# Altium schematic sheet 02cpu_power.SchDoc
size C
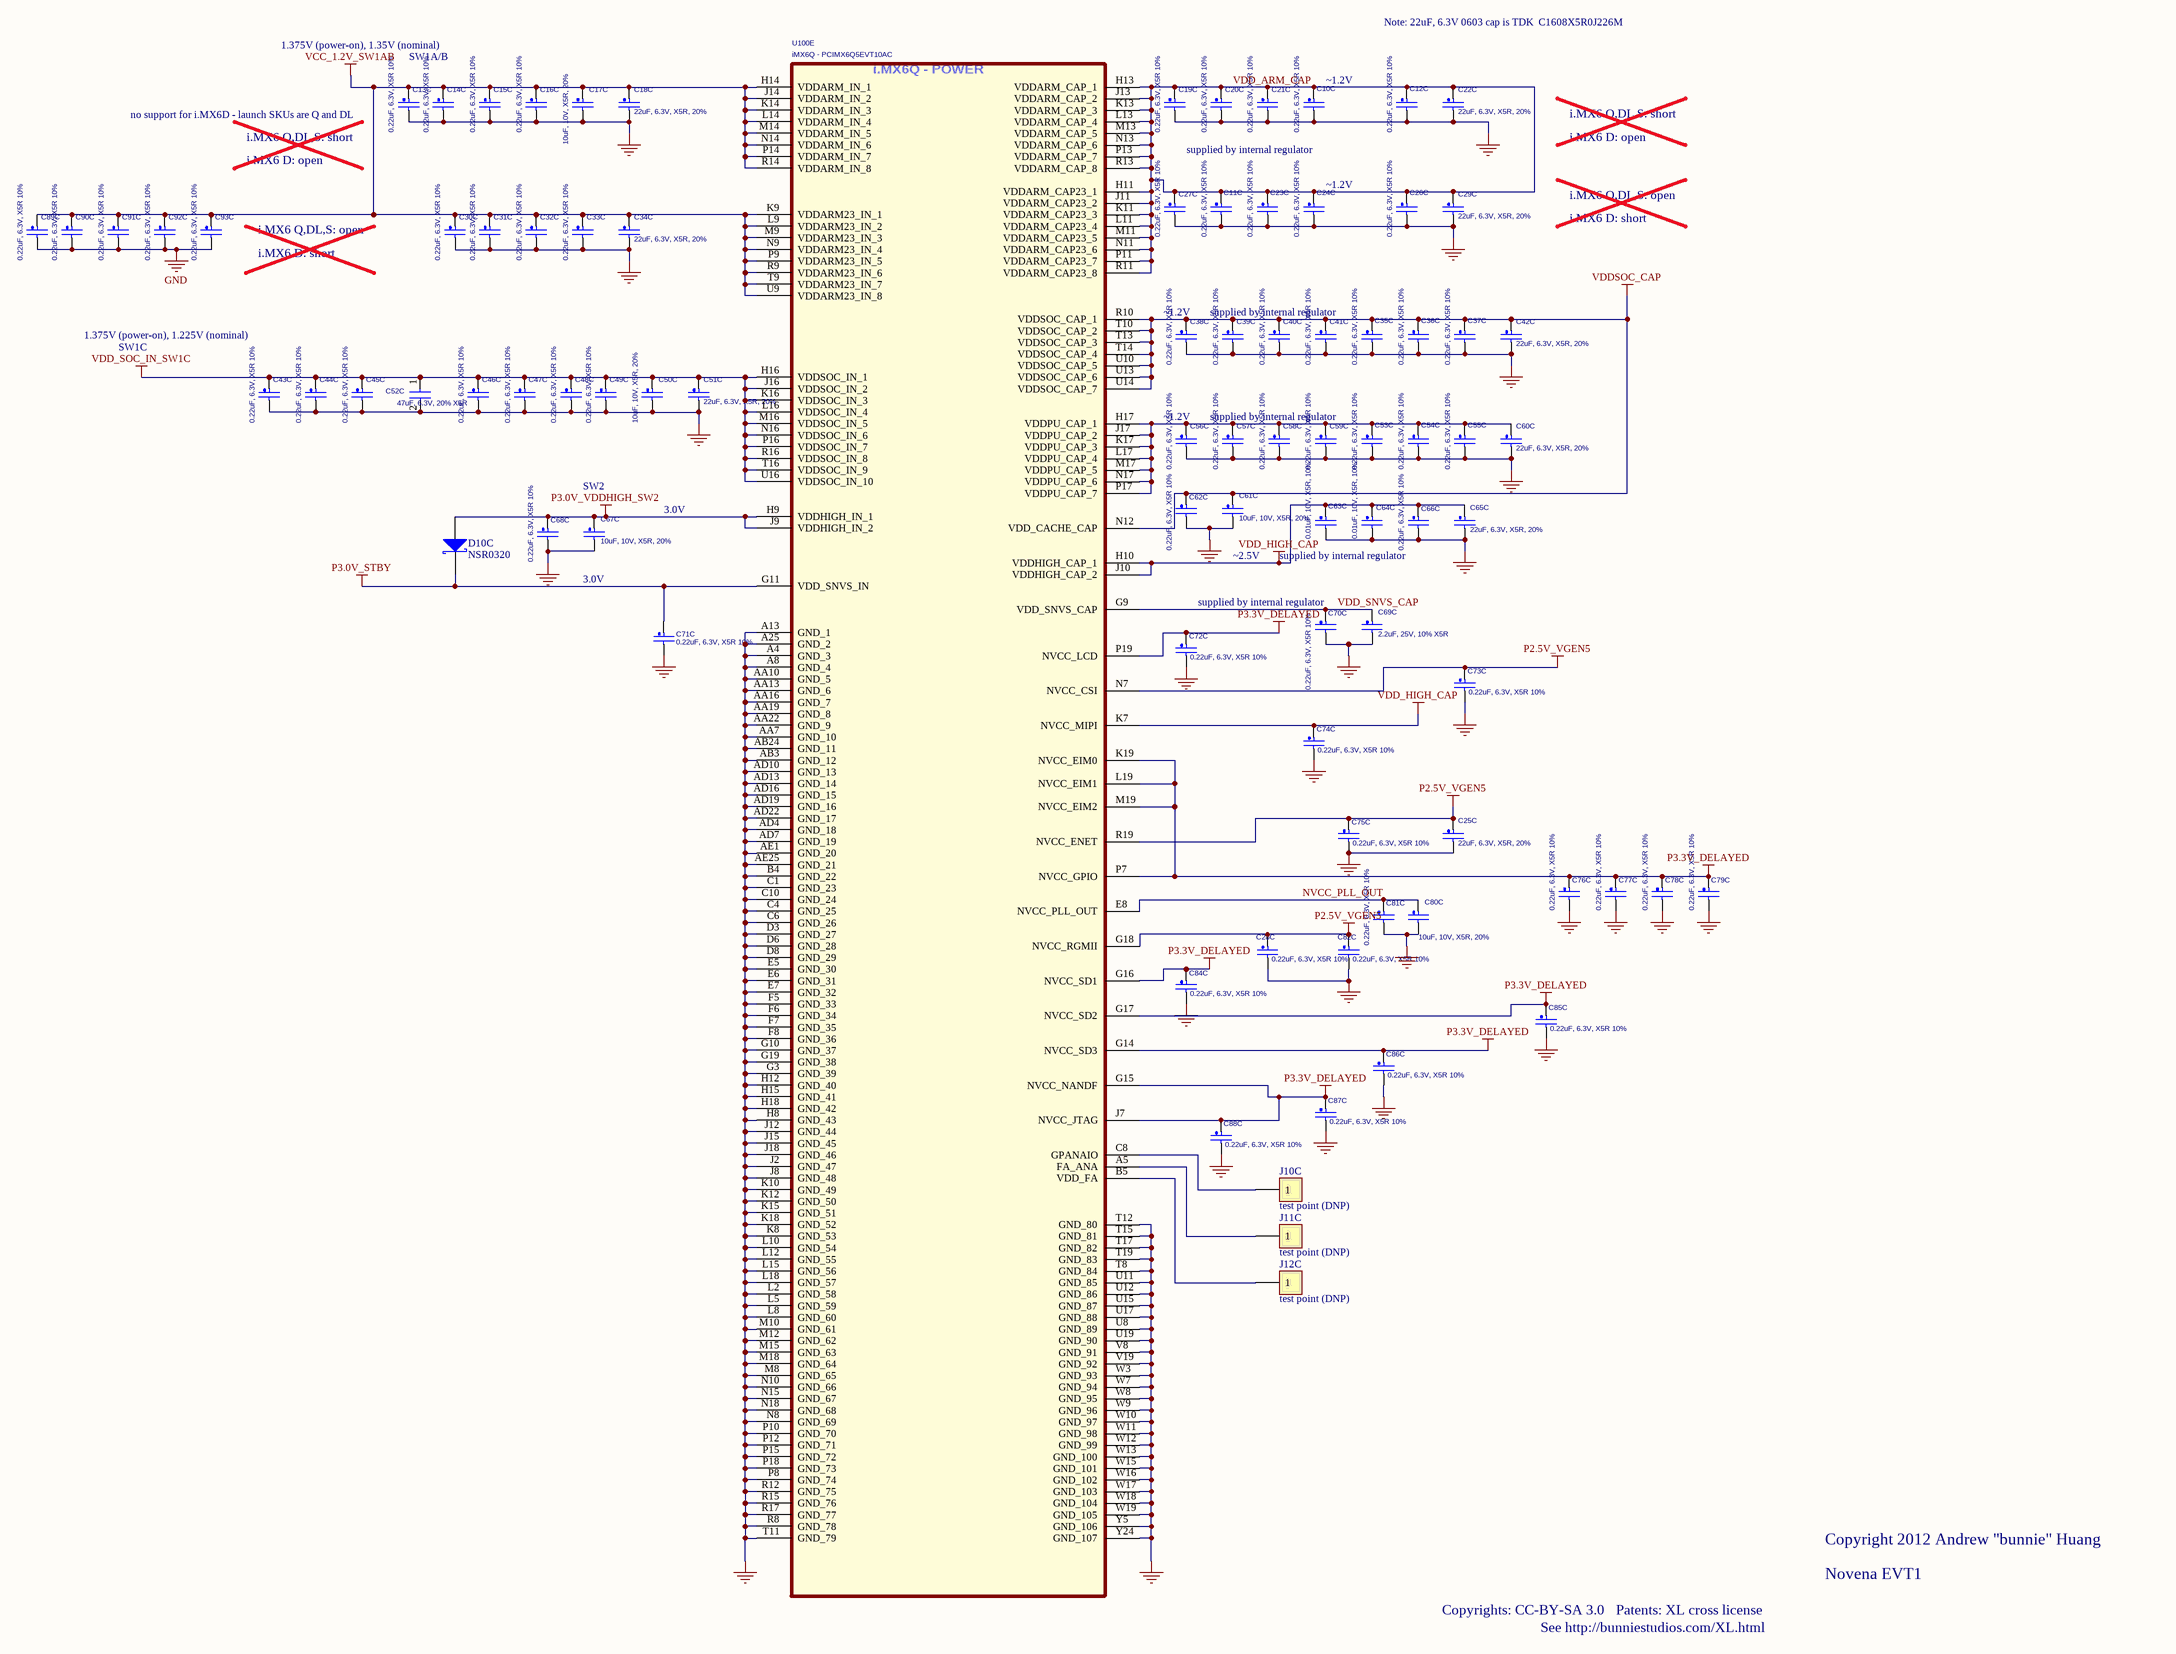
[diagram p0: 02cpu_power.SchDoc]

## Parts
C10C  0.22uF, 6.3V, X5R 10%  [CAPC0603N_B]
C11C  0.22uF, 6.3V, X5R 10%  [CAPC0603N_B]
C12C  0.22uF, 6.3V, X5R 10%  [CAPC0603N_B]
C13C  0.22uF, 6.3V, X5R 10%  [CAPC0603N_B]
C14C  0.22uF, 6.3V, X5R 10%  [CAPC0603N_B]
C15C  0.22uF, 6.3V, X5R 10%  [CAPC0603N_B]
C16C  0.22uF, 6.3V, X5R 10%  [CAPC0603N_B]
C17C  10uF, 10V, X5R, 20%  [CAPC1608N_HD]
C18C  22uF, 6.3V, X5R, 20%  [CAPC1608N_HD]
C19C  0.22uF, 6.3V, X5R 10%  [CAPC0603N_B]
C20C  0.22uF, 6.3V, X5R 10%  [CAPC0603N_B]
C21C  0.22uF, 6.3V, X5R 10%  [CAPC0603N_B]
C22C  22uF, 6.3V, X5R, 20%  [CAPC1608N_HD]
C23C  0.22uF, 6.3V, X5R 10%  [CAPC0603N_B]
C24C  0.22uF, 6.3V, X5R 10%  [CAPC0603N_B]
C25C  22uF, 6.3V, X5R, 20%  [CAPC1608N_HD]
C26C  0.22uF, 6.3V, X5R 10%  [CAPC0603N_B]
C27C  0.22uF, 6.3V, X5R 10%  [CAPC0603N_B]
C28C  0.22uF, 6.3V, X5R 10%  [CAPC0603N_B]
C29C  22uF, 6.3V, X5R, 20%  [CAPC1608N_HD]
C30C  0.22uF, 6.3V, X5R 10%  [CAPC0603N_B]
C31C  0.22uF, 6.3V, X5R 10%  [CAPC0603N_B]
C32C  0.22uF, 6.3V, X5R 10%  [CAPC0603N_B]
C33C  0.22uF, 6.3V, X5R 10%  [CAPC0603N_B]
C34C  22uF, 6.3V, X5R, 20%  [CAPC1608N_HD]
C35C  0.22uF, 6.3V, X5R 10%  [CAPC0603N_B]
C36C  0.22uF, 6.3V, X5R 10%  [CAPC0603N_B]
C37C  0.22uF, 6.3V, X5R 10%  [CAPC0603N_B]
C38C  0.22uF, 6.3V, X5R 10%  [CAPC0603N_B]
C39C  0.22uF, 6.3V, X5R 10%  [CAPC0603N_B]
C40C  0.22uF, 6.3V, X5R 10%  [CAPC0603N_B]
C41C  0.22uF, 6.3V, X5R 10%  [CAPC0603N_B]
C42C  22uF, 6.3V, X5R, 20%  [CAPC1608N_HD]
C43C  0.22uF, 6.3V, X5R 10%  [CAPC0603N_B]
C44C  0.22uF, 6.3V, X5R 10%  [CAPC0603N_B]
C45C  0.22uF, 6.3V, X5R 10%  [CAPC0603N_B]
C46C  0.22uF, 6.3V, X5R 10%  [CAPC0603N_B]
C47C  0.22uF, 6.3V, X5R 10%  [CAPC0603N_B]
C48C  0.22uF, 6.3V, X5R 10%  [CAPC0603N_B]
C49C  0.22uF, 6.3V, X5R 10%  [CAPC0603N_B]
C50C  10uF, 10V, X5R, 20%  [CAPC1608N_HD]
C51C  22uF, 6.3V, X5R, 20%  [CAPC1608N_HD]
C52C  47uF, 6.3V, 20% X5R  [CAPC3216N]
C53C  0.22uF, 6.3V, X5R 10%  [CAPC0603N_B]
C54C  0.22uF, 6.3V, X5R 10%  [CAPC0603N_B]
C55C  0.22uF, 6.3V, X5R 10%  [CAPC0603N_B]
C56C  0.22uF, 6.3V, X5R 10%  [CAPC0603N_B]
C57C  0.22uF, 6.3V, X5R 10%  [CAPC0603N_B]
C58C  0.22uF, 6.3V, X5R 10%  [CAPC0603N_B]
C59C  0.22uF, 6.3V, X5R 10%  [CAPC0603N_B]
C60C  22uF, 6.3V, X5R, 20%  [CAPC1608N_HD]
C61C  10uF, 10V, X5R, 20%  [CAPC1608N_HD]
C62C  0.22uF, 6.3V, X5R 10%  [CAPC0603N_B]
C63C  0.01uF, 10V, X5R, 10%  [CAPC0603N_B]
C64C  0.01uF, 10V, X5R, 10%  [CAPC0603N_B]
C65C  22uF, 6.3V, X5R, 20%  [CAPC1608N_HD]
C66C  0.22uF, 6.3V, X5R 10%  [CAPC0603N_B]
C67C  10uF, 10V, X5R, 20%  [CAPC1608N_HD]
C68C  0.22uF, 6.3V, X5R 10%  [CAPC0603N_B]
C69C  2.2uF, 25V, 10% X5R  [CAPC1608N_HD]
C70C  0.22uF, 6.3V, X5R 10%  [CAPC0603N_B]
C71C  0.22uF, 6.3V, X5R 10%  [CAPC0603N_B]
C72C  0.22uF, 6.3V, X5R 10%  [CAPC0603N_B]
C73C  0.22uF, 6.3V, X5R 10%  [CAPC0603N_B]
C74C  0.22uF, 6.3V, X5R 10%  [CAPC0603N_B]
C75C  0.22uF, 6.3V, X5R 10%  [CAPC0603N_B]
C76C  0.22uF, 6.3V, X5R 10%  [CAPC0603N_B]
C77C  0.22uF, 6.3V, X5R 10%  [CAPC0603N_B]
C78C  0.22uF, 6.3V, X5R 10%  [CAPC0603N_B]
C79C  0.22uF, 6.3V, X5R 10%  [CAPC0603N_B]
C80C  10uF, 10V, X5R, 20%  [CAPC1608N_HD]
C81C  0.22uF, 6.3V, X5R 10%  [CAPC0603N_B]
C82C  0.22uF, 6.3V, X5R 10%  [CAPC0603N_B]
C84C  0.22uF, 6.3V, X5R 10%  [CAPC0603N_B]
C85C  0.22uF, 6.3V, X5R 10%  [CAPC0603N_B]
C86C  0.22uF, 6.3V, X5R 10%  [CAPC0603N_B]
C87C  0.22uF, 6.3V, X5R 10%  [CAPC0603N_B]
C88C  0.22uF, 6.3V, X5R 10%  [CAPC0603N_B]
C89C  0.22uF, 6.3V, X5R 10%  [CAPC0603N_B]
C90C  0.22uF, 6.3V, X5R 10%  [CAPC0603N_B]
C91C  0.22uF, 6.3V, X5R 10%  [CAPC0603N_B]
C92C  0.22uF, 6.3V, X5R 10%  [CAPC0603N_B]
C93C  0.22uF, 6.3V, X5R 10%  [CAPC0603N_B]
D10C  NSR0320  [SOD-323]
J10C  test point (DNP)  [TP_SMT_38mil]
J11C  test point (DNP)  [TP_SMT_38mil]
J12C  test point (DNP)  [TP_SMT_38mil]
U100  iMX6Q - PCIMX6Q5EVT10AC  [FREESCALE_BGA624C80P25X25_2100X2100X216]  (part E of 12)

## Nets
GND: C10C.2 C11C.2 C12C.2 C13C.2 C14C.2 C15C.2 C16C.2 C17C.2 C18C.2 C19C.2 C20C.2 C21C.2 C22C.2 C23C.2 C24C.2 C25C.2 C26C.2 C27C.2 C28C.2 C29C.2 C30C.2 C31C.2 C32C.2 C33C.2 C34C.2 C35C.2 C36C.2 C37C.2 C38C.2 C39C.2 C40C.2 C41C.2 C42C.2 C43C.2 C44C.2 C45C.2 C46C.2 C47C.2 C48C.2 C49C.2 C50C.2 C51C.2 C52C.2 C53C.2 C54C.2 C55C.2 C56C.2 C57C.2 C58C.2 C59C.2 C60C.2 C61C.2 C62C.2 C63C.2 C64C.2 C65C.2 C66C.2 C67C.2 C68C.2 C69C.2 C70C.2 C71C.2 C72C.2 C73C.2 C74C.2 C75C.2 C76C.2 C77C.2 C78C.2 C79C.2 C80C.2 C81C.2 C82C.2 C84C.2 C85C.2 C86C.2 C87C.2 C88C.2 C89C.2 C90C.2 C91C.2 C92C.2 C93C.2 U100.A4(GND_3) U100.A8(GND_4) U100.A13(GND_1) U100.A25(GND_2) U100.AA7(GND_10) U100.AA10(GND_5) U100.AA13(GND_6) U100.AA16(GND_7) U100.AA19(GND_8) U100.AA22(GND_9) U100.AB3(GND_12) U100.AB24(GND_11) U100.AD4(GND_18) U100.AD7(GND_19) U100.AD10(GND_13) U100.AD13(GND_14) U100.AD16(GND_15) U100.AD19(GND_16) U100.AD22(GND_17) U100.AE1(GND_20) U100.AE25(GND_21) U100.B4(GND_22) U100.C1(GND_23) U100.C4(GND_25) U100.C6(GND_26) U100.C10(GND_24) U100.D3(GND_27) U100.D6(GND_28) U100.D8(GND_29) U100.E5(GND_30) U100.E6(GND_31) U100.E7(GND_32) U100.F5(GND_33) U100.F6(GND_34) U100.F7(GND_35) U100.F8(GND_36) U100.G3(GND_39) U100.G10(GND_37) U100.G19(GND_38) U100.H8(GND_43) U100.H12(GND_40) U100.H15(GND_41) U100.H18(GND_42) U100.J2(GND_47) U100.J8(GND_48) U100.J12(GND_44) U100.J15(GND_45) U100.J18(GND_46) U100.K8(GND_53) U100.K10(GND_49) U100.K12(GND_50) U100.K15(GND_51) U100.K18(GND_52) U100.L2(GND_58) U100.L5(GND_59) U100.L8(GND_60) U100.L10(GND_54) U100.L12(GND_55) U100.L15(GND_56) U100.L18(GND_57) U100.M8(GND_65) U100.M10(GND_61) U100.M12(GND_62) U100.M15(GND_63) U100.M18(GND_64) U100.N8(GND_69) U100.N10(GND_66) U100.N15(GND_67) U100.N18(GND_68) U100.P8(GND_74) U100.P10(GND_70) U100.P12(GND_71) U100.P15(GND_72) U100.P18(GND_73) U100.R8(GND_78) U100.R12(GND_75) U100.R15(GND_76) U100.R17(GND_77) U100.T8(GND_84) U100.T11(GND_79) U100.T12(GND_80) U100.T15(GND_81) U100.T17(GND_82) U100.T19(GND_83) U100.U8(GND_89) U100.U11(GND_85) U100.U12(GND_86) U100.U15(GND_87) U100.U17(GND_88) U100.U19(GND_90) U100.V8(GND_91) U100.V19(GND_92) U100.W3(GND_93) U100.W7(GND_94) U100.W8(GND_95) U100.W9(GND_96) U100.W10(GND_97) U100.W11(GND_98) U100.W12(GND_99) U100.W13(GND_100) U100.W15(GND_101) U100.W16(GND_102) U100.W17(GND_103) U100.W18(GND_104) U100.W19(GND_105) U100.Y5(GND_106) U100.Y24(GND_107)
P2.5V_VGEN5: C25C.1 C28C.1 C73C.1 C75C.1 C82C.1 U100.G18(NVCC_RGMII) U100.N7(NVCC_CSI) U100.R19(NVCC_ENET)
P3.0V_STBY: C71C.1 D10C.2(K) U100.G11(VDD_SNVS_IN)
P3.0V_VDDHIGH_SW2: C67C.1 C68C.1 D10C.1(A) U100.H9(VDDHIGH_IN_1) U100.J9(VDDHIGH_IN_2)
P3.3V_DELAYED: C72C.1 C76C.1 C77C.1 C78C.1 C79C.1 C84C.1 C85C.1 C86C.1 C87C.1 C88C.1 U100.G14(NVCC_SD3) U100.G15(NVCC_NANDF) U100.G16(NVCC_SD1) U100.G17(NVCC_SD2) U100.J7(NVCC_JTAG) U100.K19(NVCC_EIM0) U100.L19(NVCC_EIM1) U100.M19(NVCC_EIM2) U100.P7(NVCC_GPIO) U100.P19(NVCC_LCD)
VCC_1.2V_SW1AB: C13C.1 C14C.1 C15C.1 C16C.1 C17C.1 C18C.1 C30C.1 C31C.1 C32C.1 C33C.1 C34C.1 C89C.1 C90C.1 C91C.1 C92C.1 C93C.1 U100.H14(VDDARM_IN_1) U100.J14(VDDARM_IN_2) U100.K9(VDDARM23_IN_1) U100.K14(VDDARM_IN_3) U100.L9(VDDARM23_IN_2) U100.L14(VDDARM_IN_4) U100.M9(VDDARM23_IN_3) U100.M14(VDDARM_IN_5) U100.N9(VDDARM23_IN_4) U100.N14(VDDARM_IN_6) U100.P9(VDDARM23_IN_5) U100.P14(VDDARM_IN_7) U100.R9(VDDARM23_IN_6) U100.R14(VDDARM_IN_8) U100.T9(VDDARM23_IN_7) U100.U9(VDDARM23_IN_8)
VDD_HIGH_CAP: C63C.1 C64C.1 C65C.1 C66C.1 C74C.1 U100.H10(VDDHIGH_CAP_1) U100.J10(VDDHIGH_CAP_2) U100.K7(NVCC_MIPI)
VDD_SOC_IN_SW1C: C43C.1 C44C.1 C45C.1 C46C.1 C47C.1 C48C.1 C49C.1 C50C.1 C51C.1 C52C.1 U100.H16(VDDSOC_IN_1) U100.J16(VDDSOC_IN_2) U100.K16(VDDSOC_IN_3) U100.L16(VDDSOC_IN_4) U100.M16(VDDSOC_IN_5) U100.N16(VDDSOC_IN_6) U100.P16(VDDSOC_IN_7) U100.R16(VDDSOC_IN_8) U100.T16(VDDSOC_IN_9) U100.U16(VDDSOC_IN_10)
VDDSOC_CAP: C35C.1 C36C.1 C37C.1 C38C.1 C39C.1 C40C.1 C41C.1 C42C.1 C61C.1 C62C.1 U100.N12(VDD_CACHE_CAP) U100.R10(VDDSOC_CAP_1) U100.T10(VDDSOC_CAP_2) U100.T13(VDDSOC_CAP_3) U100.T14(VDDSOC_CAP_4) U100.U10(VDDSOC_CAP_5) U100.U13(VDDSOC_CAP_6) U100.U14(VDDSOC_CAP_7)
NVCC_PLL_OUT: C80C.1 C81C.1 U100.E8(NVCC_PLL_OUT)
VDD_ARM_CAP: C10C.1 C11C.1 C12C.1 C19C.1 C20C.1 C21C.1 C22C.1 C23C.1 C24C.1 C26C.1 C27C.1 C29C.1 U100.H11(VDDARM_CAP23_1) U100.H13(VDDARM_CAP_1) U100.J11(VDDARM_CAP23_2) U100.J13(VDDARM_CAP_2) U100.K11(VDDARM_CAP23_3) U100.K13(VDDARM_CAP_3) U100.L11(VDDARM_CAP23_4) U100.L13(VDDARM_CAP_4) U100.M11(VDDARM_CAP23_5) U100.M13(VDDARM_CAP_5) U100.N11(VDDARM_CAP23_6) U100.N13(VDDARM_CAP_6) U100.P11(VDDARM_CAP23_7) U100.P13(VDDARM_CAP_7) U100.R11(VDDARM_CAP23_8) U100.R13(VDDARM_CAP_8)
VDD_SNVS_CAP: C69C.1 C70C.1 U100.G9(VDD_SNVS_CAP)
NetC53C_1: C53C.1 C54C.1 C55C.1 C56C.1 C57C.1 C58C.1 C59C.1 C60C.1 U100.H17(VDDPU_CAP_1) U100.J17(VDDPU_CAP_2) U100.K17(VDDPU_CAP_3) U100.L17(VDDPU_CAP_4) U100.M17(VDDPU_CAP_5) U100.N17(VDDPU_CAP_6) U100.P17(VDDPU_CAP_7)
NetJ10C_1: J10C.1 U100.C8(GPANAIO)
NetJ11C_1: J11C.1 U100.A5(FA_ANA)
NetJ12C_1: J12C.1 U100.B5(VDD_FA)

## Notes on the sheet
- 1.375V (power-on), 1.35V (nominal)
- SW1A/B
- Note: 22uF, 6.3V 0603 cap is TDK  C1608X5R0J226M
- (near C13C) no support for i.MX6D - launch SKUs are Q and DL
- (near C10C) ~1.2V
- i.MX6 Q,DL,S: short
- i.MX6 D: open
- supplied by internal regulator
- (near C24C) ~1.2V
- i.MX6 Q,DL,S: open
- i.MX6 D: short
- 1.375V (power-on), 1.225V (nominal)
- SW1C
- (near C38C) ~1.2V
- (near C56C) ~1.2V
- SW2
- 3.0V
- (near C61C) ~2.5V
- (near C70C) supplied by internal regulator
- Copyright 2012 Andrew "bunnie" Huang
- Novena EVT1
- Copyrights: CC-BY-SA 3.0
- See http://bunniestudios.com/XL.html
- Patents: XL cross license
- (in symbol PCIMX6Q6VV1A, part E) i.MX6Q - POWER

## Library data of the parts
C10C C11C = CAP_NP_Dup1: CAP CER 0.22UF 6.3V 20% X5R 0201; CLASS: DISCRETE; PRIORITY_PN: 021-00273; FPLIST: CC0201,CC0201_HD,0201_CC,cc_0201_cir; CAD_APPROVED: YES; MFG_PN01: GRM033R70J103KA01D; MFG_NAME01: MURATA; DESCRIPTION: CAP CER 0.01UF 6.3V 10% X7R 0201; AGILE_PN: 150-75465; ROOM: CPU; HEIGHT: 0.33 MM; ROHS: Yes; Tolerance: 10%
C12C C26C C35C C54C C55C = CAP_NP_Dup1: CAP CER 0.22UF 6.3V 20% X5R 0201; CLASS: DISCRETE; ROOM: CPU; PRIORITY_PN: 021-00273; FPLIST: CC0201,CC0201_HD,0201_CC,cc_0201_cir; CAD_APPROVED: YES; MFG_PN01: GRM033R70J103KA01D; MFG_NAME01: MURATA; DESCRIPTION: CAP CER 0.01UF 6.3V 10% X7R 0201; AGILE_PN: 150-75465; HEIGHT: 0.33 MM; ROHS: Yes; Tolerance: 10%
C13C C14C C15C C16C C19C C20C C21C C27C C28C C47C C48C C62C C66C C72C C82C C84C C85C C86C C88C = CAP_NP_Dup1: CAP CER 0.22UF 6.3V 20% X5R 0201; CLASS: DISCRETE; ROOM: CPU; AGILE_PN: 150-77852; MFG_NAME01: TAIYO YUDEN; MFG_PN01: JMK063BJ224MP-F; CAD_APPROVED: Yes; FPLIST: CC0201,CC0201_HD,0201_CC; PRIORITY_PN: 021-00278; Tolerance: 20%; ROHS: Yes; HEIGHT: 0.33 MM
C17C = CAP_NP_Dup1: CAP CER 10UF 6.3V 10% X5R 0603; CLASS: DISCRETE; PRIORITY_PN: 021-00276; FPLIST: CC0603_OV,CC0603,0603_CC; CAD_APPROVED: Yes; MFG_PN01: GMC10X5R106K6R3NT-LF; MFG_NAME01: CAL-CHIP; AGILE_PN: 150-77832; HEIGHT: 1.0MM; ROHS: Yes; Tolerance: 10%
C18C C22C C25C C29C C34C C42C C51C C60C C65C = CAP_NP_Dup1: 22uF, 10V, X5R, 20%; CLASS: DISCRETE; ROOM: CPU; PRIORITY_PN: 021-00282; FPLIST: CC0805_OV,CC0805,0805_CC; CAD_APPROVED: Yes; MFG_PN01: GRM21BR60J226ME39L; MFG_NAME01: MURATA; DESCRIPTION: CAP CER 22UF 6.3V 20% X5R 0805; AGILE_PN: 150-30121; HEIGHT: 1.45MM; ROHS: Yes; Tolerance: 20%
C23C C30C C31C C32C C33C C43C C44C C45C C46C C68C C70C C71C C73C C74C C75C C76C C77C C78C C79C C81C C87C C89C C90C C91C C92C C93C = CAP_NP_Dup1: CAP CER 0.22UF 6.3V 20% X5R 0201; CLASS: DISCRETE; PRIORITY_PN: 021-00278; FPLIST: CC0201,CC0201_HD,0201_CC; CAD_APPROVED: Yes; MFG_PN01: JMK063BJ224MP-F; MFG_NAME01: TAIYO YUDEN; AGILE_PN: 150-77852; ROOM: CPU; HEIGHT: 0.33 MM; ROHS: Yes; Tolerance: 20%
C24C C36C C37C C53C = CAP_NP_Dup1: CAP CER 0.22UF 6.3V 20% X5R 0201; CLASS: DISCRETE; AGILE_PN: 150-75465; DESCRIPTION: CAP CER 0.01UF 6.3V 10% X7R 0201; MFG_NAME01: MURATA; MFG_PN01: GRM033R70J103KA01D; CAD_APPROVED: YES; FPLIST: CC0201,CC0201_HD,0201_CC,cc_0201_cir; PRIORITY_PN: 021-00273; ROOM: CPU; Tolerance: 10%; ROHS: Yes; HEIGHT: 0.33 MM
C38C C39C C40C C41C C49C C59C = CAP_NP_Dup1: CAP CER 0.22UF 6.3V 20% X5R 0201; CLASS: DISCRETE; ROOM: CPU; PRIORITY_PN: 021-00278; FPLIST: CC0201,CC0201_HD,0201_CC; CAD_APPROVED: Yes; MFG_PN01: JMK063BJ224MP-F; MFG_NAME01: TAIYO YUDEN; AGILE_PN: 150-77852; HEIGHT: 0.33 MM; ROHS: Yes; Tolerance: 20%
C50C C61C C67C C80C = CAP_NP_Dup1: CAP CER 10UF 6.3V 10% X5R 0603; CLASS: DISCRETE; AGILE_PN: 150-77832; MFG_NAME01: CAL-CHIP; MFG_PN01: GMC10X5R106K6R3NT-LF; CAD_APPROVED: Yes; FPLIST: CC0603_OV,CC0603,0603_CC; PRIORITY_PN: 021-00276; Tolerance: 10%; ROHS: Yes; HEIGHT: 1.0MM
C52C = C
C56C C57C C58C = CAP_NP_Dup1: CAP CER 0.22UF 6.3V 20% X5R 0201; CLASS: DISCRETE; AGILE_PN: 150-77852; MFG_NAME01: TAIYO YUDEN; MFG_PN01: JMK063BJ224MP-F; CAD_APPROVED: Yes; FPLIST: CC0201,CC0201_HD,0201_CC; PRIORITY_PN: 021-00278; ROOM: CPU; Tolerance: 20%; ROHS: Yes; HEIGHT: 0.33 MM
C63C C64C = CAP_NP_Dup1: 0.01uF, 10V, X5R; CLASS: DISCRETE; PRIORITY_PN: 021-00273; FPLIST: CC0201,CC0201_HD,0201_CC,cc_0201_cir; CAD_APPROVED: YES; MFG_PN01: GRM033R70J103KA01D; MFG_NAME01: MURATA; DESCRIPTION: CAP CER 0.01UF 6.3V 10% X7R 0201; AGILE_PN: 150-75465; ROOM: CPU; HEIGHT: 0.33 MM; ROHS: Yes; Tolerance: 10%
C69C = CAP_NP_Dup1: CAP CER 2.2UF 25V 10% X5R 0603; CLASS: DISCRETE; PRIORITY_PN: 021-00276; FPLIST: CC0603_OV,CC0603,0603_CC; CAD_APPROVED: Yes; MFG_PN01: GMC10X5R106K6R3NT-LF; MFG_NAME01: CAL-CHIP; DESCRIPTION: CAP CER 10UF 6.3V 10% X5R 0603; AGILE_PN: 150-77832; HEIGHT: 1.0MM; ROHS: Yes; Tolerance: 10%
D10C = D Schottky: Schottky Diode; Code - JEDEC: DO-214-AA; Published: 8-Jun-2000; Publisher: Altium Limited; Revision: July-2002: Re-released for DXP Platform.
J10C J11C J12C = CON1: Connector
U100 = PCIMX6Q6VV1A: PCIMX6Q5EVT10AC; AGILE_PN: TMP-WF-14526; DESCRIPTION: PLACEHOLDER FOR FREESCALE PART NUMBER PMCIMX6Q6VV1A.; MFG_NAME01: Freescale Semiconductor; PRE_APN: 344-01218; MFG_PN01: PCIMX6Q6VV1A; ROHS: Yes; HEIGHT: 2.16MM